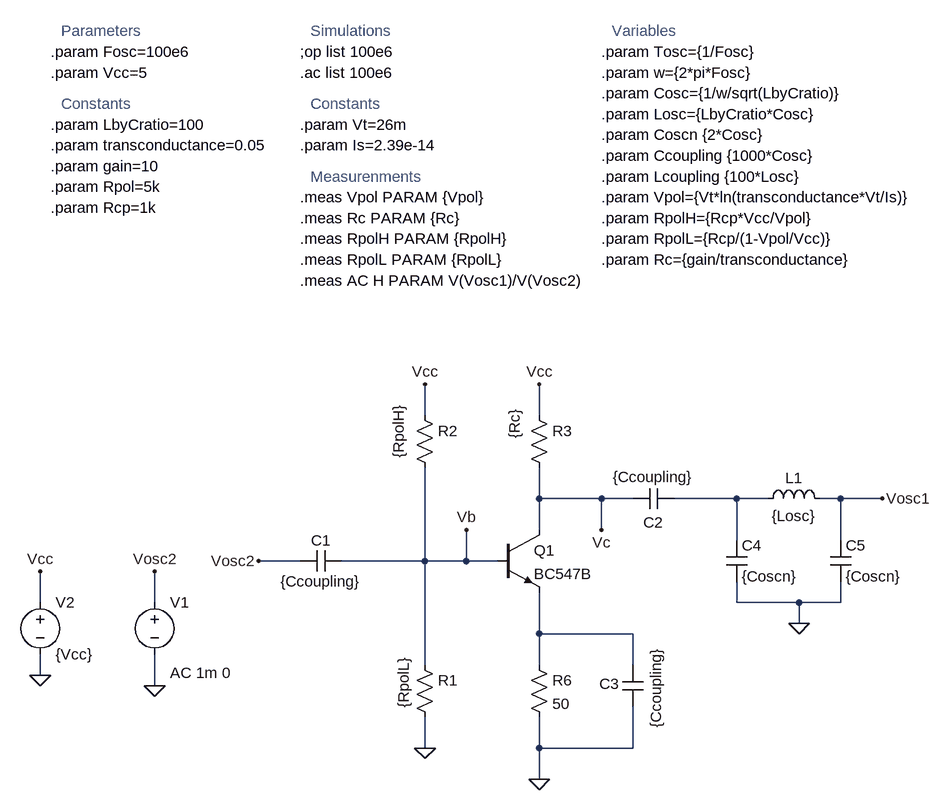
[diagram p0: schematic AmplifierSym.asc]
AmplifierSym.asc, the LTspice schematic file:
Version 4
SHEET 1 2540 748
WIRE 176 144 176 96
WIRE 352 144 352 96
WIRE 352 272 352 224
WIRE 448 272 352 272
WIRE 496 272 448 272
WIRE 656 272 560 272
WIRE 704 272 656 272
WIRE 816 272 784 272
WIRE 880 272 816 272
WIRE 352 320 352 272
WIRE 448 320 448 272
WIRE 656 336 656 272
WIRE 816 336 816 272
WIRE -16 368 -80 368
WIRE 176 368 176 224
WIRE 176 368 48 368
WIRE 240 368 240 320
WIRE 240 368 176 368
WIRE 288 368 240 368
WIRE -416 432 -416 384
WIRE -240 432 -240 384
WIRE 656 432 656 400
WIRE 752 432 656 432
WIRE 816 432 816 400
WIRE 816 432 752 432
WIRE 752 464 752 432
WIRE 352 480 352 416
WIRE 496 480 352 480
WIRE 176 528 176 368
WIRE 352 528 352 480
WIRE 496 528 496 480
WIRE -416 544 -416 512
WIRE -240 560 -240 512
WIRE 176 656 176 608
WIRE 352 656 352 608
WIRE 496 656 496 592
WIRE 496 656 352 656
WIRE 352 704 352 656
FLAG 176 656 0
FLAG 352 704 0
FLAG -80 368 Vosc2
FLAG -240 560 0
FLAG -240 384 Vosc2
FLAG 880 272 Vosc1
FLAG -416 384 Vcc
FLAG -416 544 0
FLAG 176 96 Vcc
FLAG 352 96 Vcc
FLAG 240 320 Vb
FLAG 448 320 Vc
FLAG 752 464 0
SYMBOL cap 48 352 R90
WINDOW 0 0 32 VBottom 2
WINDOW 3 32 32 VTop 2
SYMATTR InstName C1
SYMATTR Value {Ccoupling}
SYMBOL res 160 512 R0
WINDOW 3 -17 3 VRight 2
SYMATTR Value {RpolL}
SYMATTR InstName R1
SYMBOL res 160 128 R0
WINDOW 3 -24 -2 VRight 2
SYMATTR Value {RpolH}
SYMATTR InstName R2
SYMBOL npn 288 320 R0
SYMATTR InstName Q1
SYMATTR Value BC547B
SYMBOL res 336 128 R0
WINDOW 3 -22 6 VRight 2
SYMATTR Value {Rc}
SYMATTR InstName R3
SYMBOL res 336 512 R0
SYMATTR InstName R6
SYMATTR Value 50
SYMBOL cap 480 528 R0
WINDOW 0 -35 29 Left 2
WINDOW 3 52 -26 VRight 2
SYMATTR InstName C3
SYMATTR Value {Ccoupling}
SYMBOL voltage -240 416 R0
WINDOW 123 24 124 Left 2
WINDOW 39 0 0 Left 0
SYMATTR Value ""
SYMATTR Value2 AC 1m 0
SYMATTR InstName V1
SYMBOL cap 560 256 R90
WINDOW 0 68 32 VBottom 2
WINDOW 3 -33 33 VTop 2
SYMATTR InstName C2
SYMATTR Value {Ccoupling}
SYMBOL voltage -416 416 R0
WINDOW 123 0 0 Left 0
WINDOW 39 0 0 Left 0
SYMATTR InstName V2
SYMATTR Value {Vcc}
SYMBOL cap 640 336 R0
SYMATTR InstName C4
SYMATTR Value {Coscn}
SYMBOL cap 800 336 R0
SYMATTR InstName C5
SYMATTR Value {Coscn}
SYMBOL ind 688 288 R270
WINDOW 0 32 56 VTop 2
WINDOW 3 5 56 VBottom 2
SYMATTR InstName L1
SYMATTR Value {Losc}
TEXT -400 -416 Left 2 !.param Fosc=100e6
TEXT -400 -304 Left 2 !.param LbyCratio=100
TEXT 448 -416 Left 2 !.param Tosc={1/Fosc}
TEXT 0 -336 Left 2 ;Constants
TEXT -384 -336 Left 2 ;Constants
TEXT -384 -448 Left 2 ;Parameters
TEXT -16 -416 Left 2 !;op list 100e6
TEXT 464 -448 Left 2 ;Variables
TEXT -16 -304 Left 2 !.param Vt=26m
TEXT 448 -192 Left 2 !.param Vpol={Vt*ln(transconductance*Vt/Is)}
TEXT -16 -192 Left 2 !.meas Vpol PARAM {Vpol}
TEXT 0 -224 Left 2 ;Measurenments
TEXT -16 -160 Left 2 !.meas Rc PARAM {Rc}
TEXT -16 -272 Left 2 !.param Is=2.39e-14
TEXT 0 -448 Left 2 ;Simulations
TEXT -400 -384 Left 2 !.param Vcc=5
TEXT -400 -272 Left 2 !.param transconductance=0.05
TEXT -400 -240 Left 2 !.param gain=10
TEXT -400 -208 Left 2 !.param Rpol=5k
TEXT 448 -384 Left 2 !.param w={2*pi*Fosc}
TEXT 448 -352 Left 2 !.param Cosc={1/w/sqrt(LbyCratio)}
TEXT 448 -320 Left 2 !.param Losc={LbyCratio*Cosc}
TEXT 448 -128 Left 2 !.param RpolL={Rcp/(1-Vpol/Vcc)}
TEXT 448 -160 Left 2 !.param RpolH={Rcp*Vcc/Vpol}
TEXT 448 -96 Left 2 !.param Rc={gain/transconductance}
TEXT 448 -256 Left 2 !.param Ccoupling {1000*Cosc}
TEXT 448 -224 Left 2 !.param Lcoupling {100*Losc}
TEXT 448 -288 Left 2 !.param Coscn {2*Cosc}
TEXT -400 -176 Left 2 !.param Rcp=1k
TEXT -16 -128 Left 2 !.meas RpolH PARAM {RpolH}
TEXT -16 -96 Left 2 !.meas RpolL PARAM {RpolL}
TEXT -16 -384 Left 2 !.ac list 100e6
TEXT -16 -64 Left 2 !.meas AC H PARAM V(Vosc1)/V(Vosc2)

The netlist it stands for:
* AmplifierSym.asc
C1 Vb Vosc2 {Ccoupling}
R1 Vb 0 {RpolL}
R2 Vcc Vb {RpolH}
Q1 Vc Vb N002 0 BC547B
R3 Vcc Vc {Rc}
R6 N002 0 50
C3 N002 0 {Ccoupling}
V1 Vosc2 0 AC 1m 0
C2 N001 Vc {Ccoupling}
V2 Vcc 0 {Vcc}
C4 N001 0 {Coscn}
C5 Vosc1 0 {Coscn}
L1 N001 Vosc1 {Losc}
.model NPN NPN
.model PNP PNP
.lib standard.bjt
.param Fosc=100e6
.param LbyCratio=100
.param Tosc={1/Fosc}
* Constants
* Constants
* Parameters
;op list 100e6
* Variables
.param Vt=26m
.param Vpol={Vt*ln(transconductance*Vt/Is)}
.meas Vpol PARAM {Vpol}
* Measurenments
.meas Rc PARAM {Rc}
.param Is=2.39e-14
* Simulations
.param Vcc=5
.param transconductance=0.05
.param gain=10
.param Rpol=5k
.param w={2*pi*Fosc}
.param Cosc={1/w/sqrt(LbyCratio)}
.param Losc={LbyCratio*Cosc}
.param RpolL={Rcp/(1-Vpol/Vcc)}
.param RpolH={Rcp*Vcc/Vpol}
.param Rc={gain/transconductance}
.param Ccoupling {1000*Cosc}
.param Lcoupling {100*Losc}
.param Coscn {2*Cosc}
.param Rcp=1k
.meas RpolH PARAM {RpolH}
.meas RpolL PARAM {RpolL}
.ac list 100e6
.meas AC H PARAM V(Vosc1)/V(Vosc2)
.backanno
.end